# EAGLE design Placa ATMEL 2019 v2 (EAGLE 7.6.0)
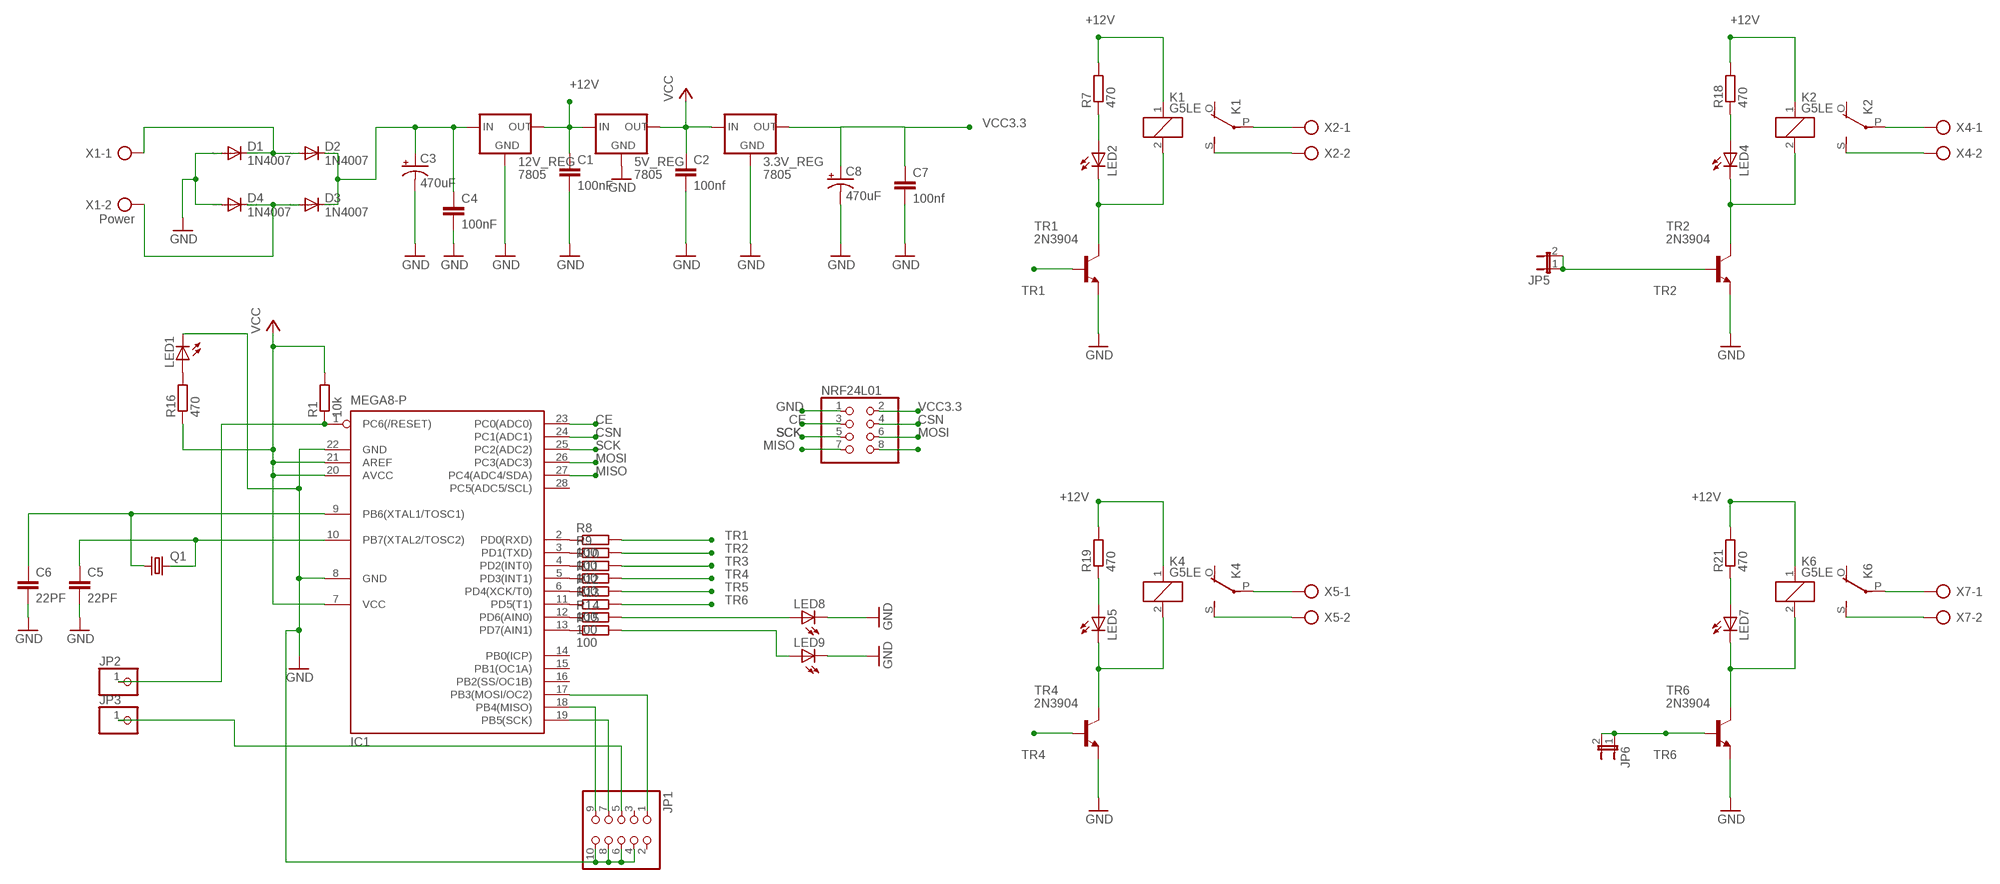
[diagram p0: schematic, sheet 1]

## Parts
3.3V_REG  7805  78XXL  [78XXL]
5V_REG  7805  78XXL  [78XXL]
12V_REG  7805  78XXL  [78XXL]
C1  100nF  C-EU050-025X075  [C050-025X075]
C2  100nf  C-EU050-025X075  [C050-025X075]
C3  470uF  CPOL-USE7.5-16  [E7,5-16]
C4  100nF  C-EU050-025X075  [C050-025X075]
C5  22PF  C-EU050-024X044  [C050-024X044]
C6  22PF  C-EU050-024X044  [C050-024X044]
C7  100nf  C-EU050-025X075  [C050-025X075]
C8  470uF  CPOL-USE7.5-16  [E7,5-16]
D1  1N4007  1N4004  [DO41-10]
D2  1N4007  1N4004  [DO41-10]
D3  1N4007  1N4004  [DO41-10]
D4  1N4007  1N4004  [DO41-10]
IC1  MEGA8-P  [DIL28-3]
JP1  PINHD-2X5  [2X05]
JP2  PINHD-1X1  [1X01]
JP3  PINHD-1X1  [1X01]
JP5  JP1E  [JP1]
JP6  JP1E  [JP1]
K1  G5LE  [G5LE]
K2  G5LE  [G5LE]
K4  G5LE  [G5LE]
K6  G5LE  [G5LE]
LED1  LED5MM  [LED5MM]
LED2  LED5MM  [LED5MM]
LED4  LED5MM  [LED5MM]
LED5  LED5MM  [LED5MM]
LED7  LED5MM  [LED5MM]
LED8  LED5MM  [LED5MM]
LED9  LED5MM  [LED5MM]
NRF24L01  PINHD-2X4  [2X04]
Q1  CRYSTALHC49S  [HC49/S]
R1  10k  R-EU_0207/10  [0207/10]
R7  470  R-EU_0309/10  [0309/10]
R8  100  R-EU_0207/10  [0207/10]
R9  100  R-EU_0207/10  [0207/10]
R10  100  R-EU_0207/15  [0207/15]
R11  100  R-EU_0207/10  [0207/10]
R12  R-EU_0207/15  [0207/15]
R13  100  R-EU_0207/15  [0207/15]
R14  100  R-EU_0207/10  [0207/10]
R15  100  R-EU_0207/10  [0207/10]
R16  470  R-EU_0309/10  [0309/10]
R18  470  R-EU_0309/10  [0309/10]
R19  470  R-EU_0309/10  [0309/10]
R21  470  R-EU_0309/10  [0309/10]
TR1  2N3904  [TO92]
TR2  2N3904  [TO92]
TR4  2N3904  [TO92]
TR6  2N3904  [TO92]
X1  Power  AK500/2  [AK500/2]
X2  AK300/2  [AK300/2]
X4  AK300/2  [AK300/2]
X5  AK300/2  [AK300/2]
X7  AK300/2  [AK300/2]

## Nets
+12V: 5V_REG.IN 12V_REG.OUT C1.1 K1.1 K2.1 K4.1 K6.1 R7.2 R18.2 R19.2 R21.2
CE: IC1.23(PC0(ADC0)) NRF24L01.3
CSN: IC1.24(PC1(ADC1)) NRF24L01.4
GND: 3.3V_REG.GND 5V_REG.GND 12V_REG.GND C1.2 C2.2 C3.- C4.2 C5.2 C6.2 C7.2 C8.- D1.A D4.A IC1.8(GND) IC1.22(GND) JP1.4 JP1.6 JP1.8 JP1.10 LED1.K(C) LED8.K(C) LED9.K(C) NRF24L01.1 TR1.3(E) TR2.3(E) TR4.3(E) TR6.3(E)
MISO: IC1.27(PC4(ADC4/SDA)) NRF24L01.7
MOSI: IC1.26(PC3(ADC3)) NRF24L01.6
N$1: JP1.5 JP3.1
N$2: 12V_REG.IN C3.+ C4.1 D2.C D3.C
N$3: K4.S(2:S) X5.2
N$4: K1.S(2:S) X2.2
N$5: K2.S(2:S) X4.2
N$6: LED2.A R7.1
N$7: IC1.2(PD0(RXD)) R8.1
N$8: IC1.3(PD1(TXD)) R9.1
N$9: IC1.4(PD2(INT0)) R10.1
N$10: IC1.5(PD3(INT1)) R11.1
N$11: IC1.6(PD4(XCK/T0)) R12.1
N$12: IC1.11(PD5(T1)) R13.1
N$13: IC1.12(PD6(AIN0)) R14.1
N$14: IC1.13(PD7(AIN1)) R15.1
N$15: K6.S(2:S) X7.2
N$16: IC1.17(PB3(MOSI/OC2)) JP1.1
N$17: LED1.A R16.2
N$18: IC1.19(PB5(SCK)) JP1.7
N$19: IC1.18(PB4(MISO)) JP1.9
N$24: D1.C D2.A X1.1
N$29: K1.2 LED2.K(C) TR1.1(C)
N$32: K1.P(2:P) X2.1
N$65: D3.A D4.C X1.2
N$71: LED4.A R18.1
N$81: K2.2 LED4.K(C) TR2.1(C)
N$84: K2.P(2:P) X4.1
N$85: LED5.A R19.1
N$86: K4.2 LED5.K(C) TR4.1(C)
N$89: K4.P(2:P) X5.1
N$111: IC1.1(PC6(/RESET)) JP2.1 R1.1
N$118: LED7.A R21.1
N$135: C5.1 IC1.10(PB7(XTAL2/TOSC2)) Q1.2
N$136: C6.1 IC1.9(PB6(XTAL1/TOSC1)) Q1.1
N$138: K6.2 LED7.K(C) TR6.1(C)
N$148: K6.P(2:P) X7.1
N$152: LED8.A R14.2
N$153: LED9.A R15.2
N$157: NRF24L01.8
SCK: IC1.25(PC2(ADC2)) NRF24L01.5
TR1: R8.2 TR1.2(B)
TR2: JP5.1 JP5.2 R9.2 TR2.2(B)
TR3: R10.2
TR4: R11.2 TR4.2(B)
TR5: R12.2
TR6: JP6.1 JP6.2 R13.2 TR6.2(B)
VCC: 3.3V_REG.IN 5V_REG.OUT C2.1 IC1.7(VCC) IC1.20(AVCC) IC1.21(AREF) R1.2 R16.1
VCC3.3: 3.3V_REG.OUT C7.1 C8.+ NRF24L01.2
Unconnected: IC1.14(PB0(ICP)) IC1.15(PB1(OC1A)) IC1.16(PB2(SS/OC1B)) IC1.28(PC5(ADC5/SCL)) JP1.2 JP1.3 K1.O(2:O) K2.O(2:O) K4.O(2:O) K6.O(2:O)

## Library data of the parts
3.3V_REG 5V_REG 12V_REG = v-reg:78XXL: VOLTAGE REGULATOR
C1 C2 C4-C7 = rcl:C-EU: CAPACITOR, European symbol
C3 C8 = rcl:CPOL-US: POLARIZED CAPACITOR, American symbol
D1-D4 = diode:1N4004: DIODE general purpose rectifier, 1 A
IC1 = atmel:MEGA8-P: MICROCONTROLLER 8 Kbytes FLASH, 1 kbytes SRAM, 512 bytes EEPROM, USART, 4-channel 10 bit ADC, 2-channel 8 bit ADC Pin compatible with Atmega48, ATMega88, ATMega168 Source: avr.lbr; OC_FARNELL: unknown; OC_NEWARK: unknown
JP1 = pinhead:PINHD-2X5: PIN HEADER
JP2 JP3 = pinhead:PINHD-1X1: PIN HEADER
JP5 JP6 = jumper:JP1E: JUMPER
K1 K2 K4 K6 = relay:G5LE: RELAY 1 x switch, 10 A/120 V AC, 8 A/30 V DC, Omron; OC_FARNELL: unknown; OC_NEWARK: unknown
LED1 LED2 LED4 LED5 LED7-LED9 = led:LED: LED OSRAM: - CHIPLED LG R971, LG N971, LY N971, LG Q971, LY Q971, LO R971, LY R971 LH N974, LH R974 LS Q976, LO Q976, LY Q976 LO Q996 - Hyper CHIPLED LW Q18S LB Q993, LB Q99A, LB R99A - SideLED LS A670, LO A670, LY A670, LG A670, LP A670 LB A673, LV A673, LT A673, LW A673 LH A674 LY A675 LS A676, LA A676, LO A676, LY A676, LW A676 LS A679, LY A679, LG A679 - Hyper Micro SIDELED® LS Y876, LA Y876, LO Y876, LY Y876 LT Y87S - SmartLED LW L88C, LW L88S LB L89C, LB L89S, LG L890 LS L89K, LO L89K, LY L89K LS L896, LA L896, LO L896, LY L896 - TOPLED LS T670, LO T670, LY T670, LG T670, LP T670 LSG T670, LSP T670, LSY T670, LOP T670, LYG T670 LG T671, LOG T671, LSG T671 LB T673, LV T673, LT T673, LW T673 LH T674 LS T676, LA T676, LO T676, LY T676, LB T676, LH T676, LSB T676, LW T676 LB T67C, LV T67C, LT T67C, LS T67K, LO T67K, LY T67K, LW E67C LS E67B, LA E67B, LO E67B, LY E67B, LB E67C, LV E67C, LT E67C LW T67C LS T679, LY T679, LG T679 LS T770, LO T770, LY T770, LG T770, LP T770 LB T773, LV T773, LT T773, LW T773 LH T774 LS E675, LA E675, LY E675, LS T675 LS T776, LA T776, LO T776, LY T776, LB T776 LHGB T686 LT T68C, LB T68C - Hyper Mini TOPLED® LB M676 - Mini TOPLED Santana® LG M470 LS M47K, LO M47K, LY M47K Source: http://www.osram.convergy.de LUXEON: - LUMILED® LXK2-PW12-R00, LXK2-PW12-S00, LXK2-PW14-U00, LXK2-PW14-V00 LXK2-PM12-R00, LXK2-PM12-S00, LXK2-PM14-U00 LXK2-PE12-Q00, LXK2-PE12-R00, LXK2-PE12-S00, LXK2-PE14-T00, LXK2-PE14-U00 LXK2-PB12-K00, LXK2-PB12-L00, LXK2-PB12-M00, LXK2-PB14-N00, LXK2-PB14-P00, LXK2-PB14-Q00 LXK2-PR12-L00, LXK2-PR12-M00, LXK2-PR14-Q00, LXK2-PR14-R00 LXK2-PD12-Q00, LXK2-PD12-R00, LXK2-PD12-S00 LXK2-PH12-R00, LXK2-PH12-S00 LXK2-PL12-P00, LXK2-PL12-Q00, LXK2-PL12-R00 Source: www.luxeon.com KINGBRIGHT: KA-3528ASYC Source: www.kingbright.com
NRF24L01 = pinhead:PINHD-2X4: PIN HEADER
Q1 = crystal:CRYSTAL: CRYSTAL; OC_FARNELL: 1667008; OC_NEWARK: unknown
R1 R7-R16 R18 R19 R21 = rcl:R-EU_: RESISTOR, European symbol
TR1 TR2 TR4 TR6 = transistor-npn:2N3904: NPN Transistor
X1 = con-ptr500:AK500/2: CONNECTOR; OC_FARNELL: unknown; OC_NEWARK: unknown
X2 X4 X5 X7 = con-ptr500:AK300/2: CONNECTOR; OC_FARNELL: unknown; OC_NEWARK: unknown

## Board
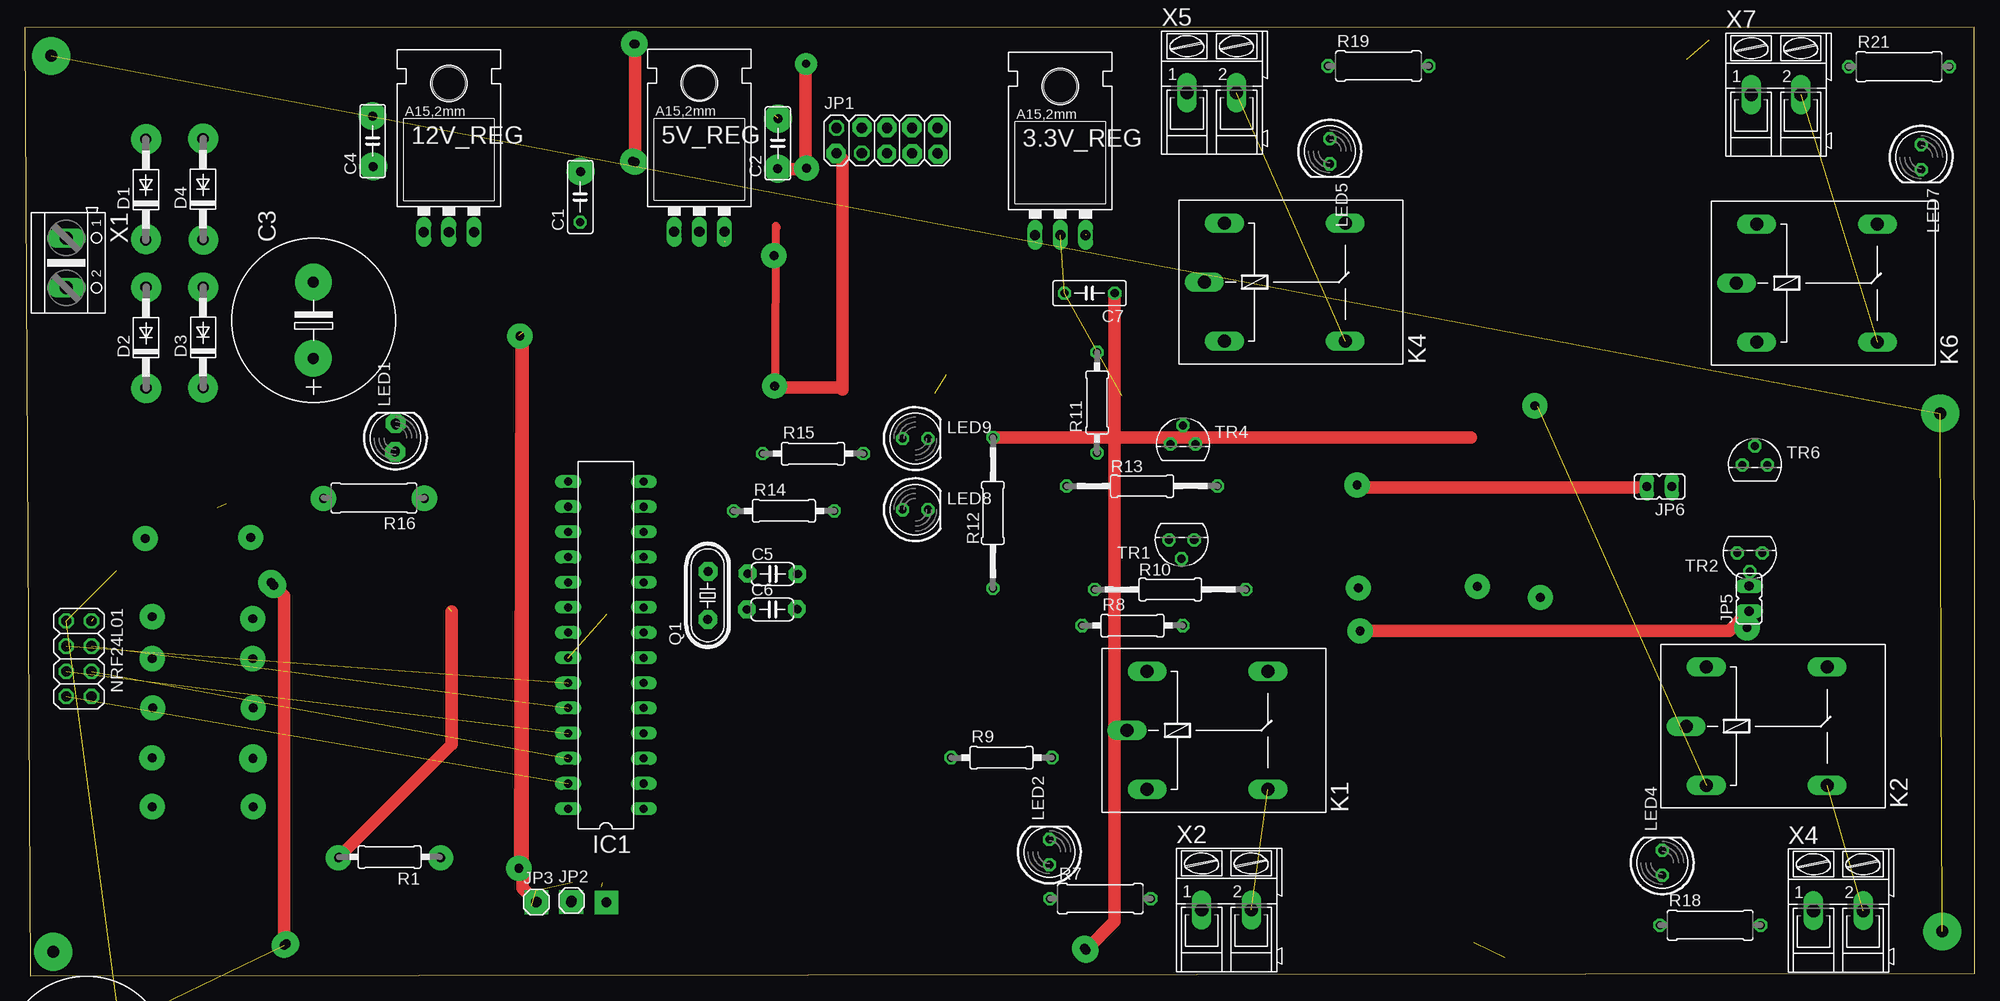
[diagram p1: board, top side]
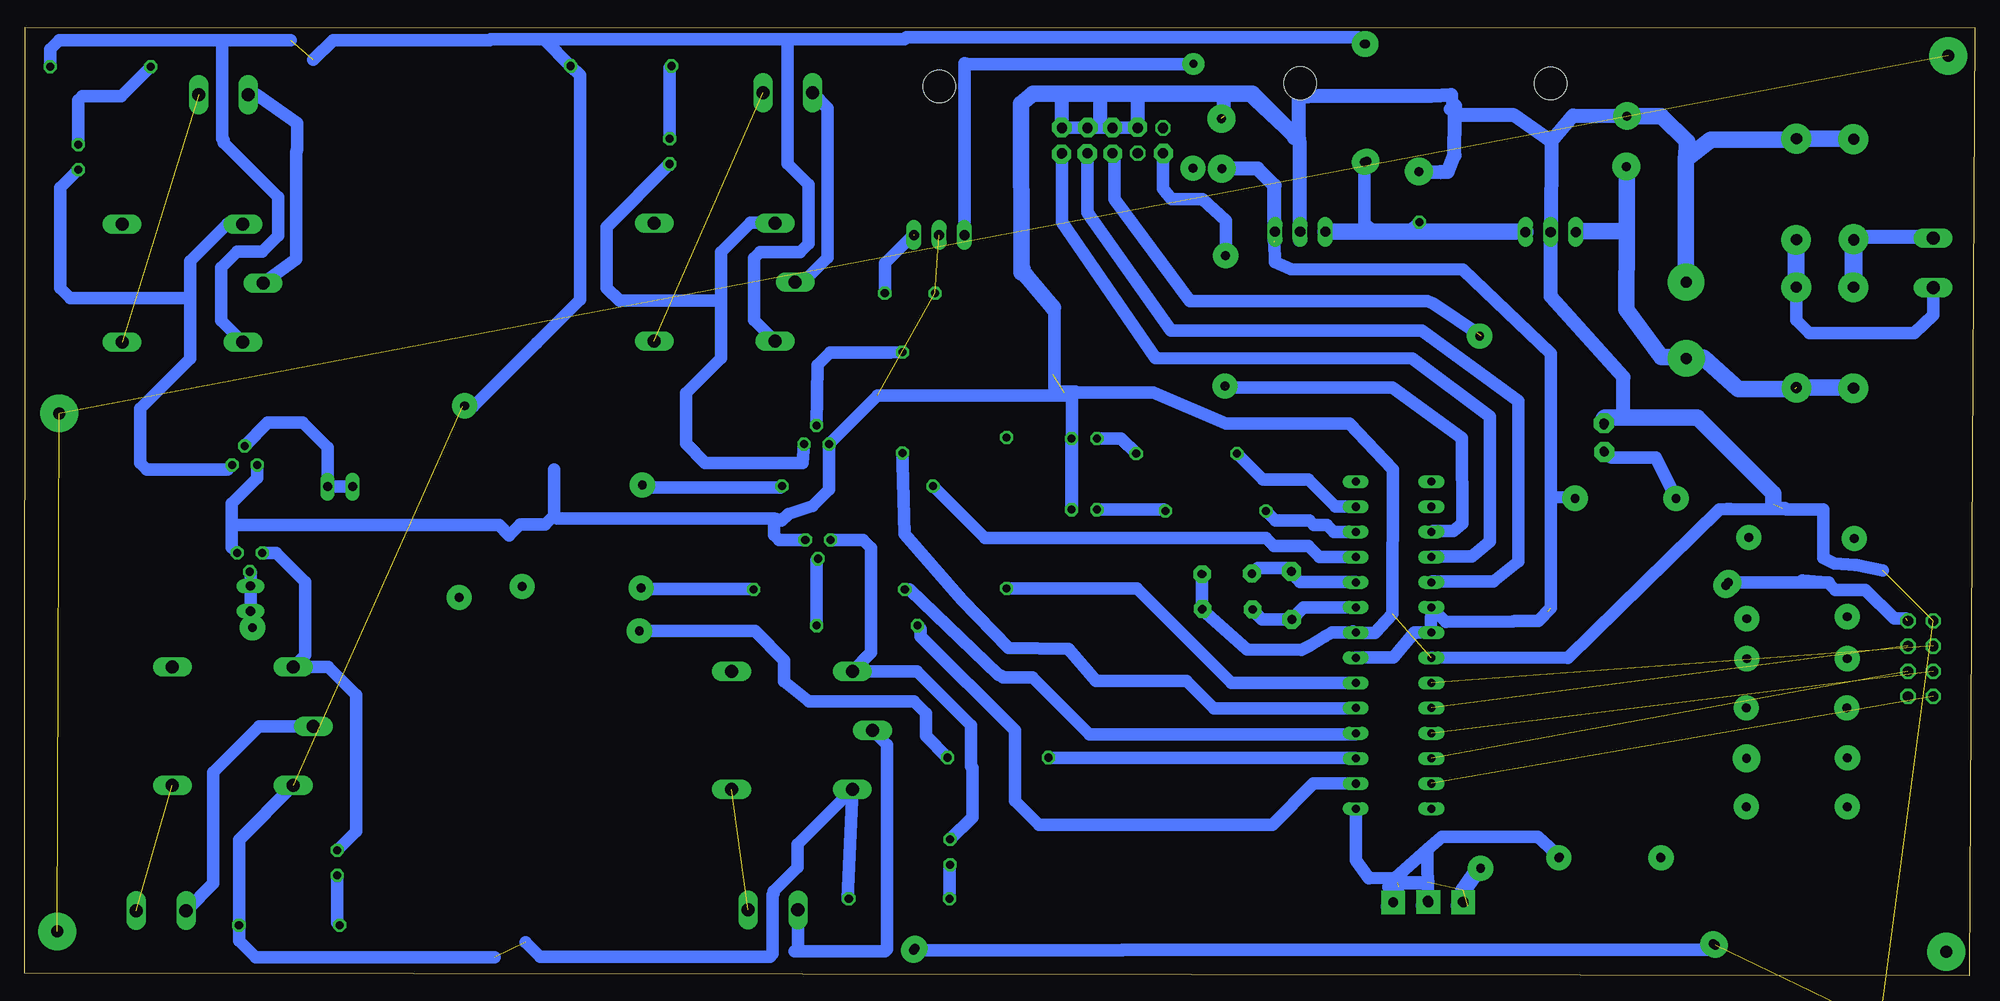
[diagram p2: board, bottom side, seen from below]

Size 196.74 x 95.72 mm. Coordinates in mm from the lower left corner, seen from the top.
Outline: 0.57,0 196.74,0.28 196.7,95.72 0,95.7 0.57,0
Copper layers (1*16): Top 0.035mm / dielectric 1.5mm / Bottom 0.035mm
Design rules "default *": minimum track width 10mil, minimum drill 24mil, track to track 1mm, track to pad 1mm, pad to pad 1mm, via to via 1mm, smd to smd 1mm, copper to edge 1mm, drill to drill 1mm, minimum pad ring 10mil, minimum via ring 8mil, stop-mask expansion 4mil, vias tented up to drill 0mil, thermal gap 10mil

### Footprints (pad centres in the part's own frame; a part is rotated, then mirrored left to right if it is on the bottom)
78XXL = drill 1.016 long: GND 0,-3.81; IN -2.54,-3.81; OUT 2.54,-3.81 | hole 3.302: 0,11.176
C050-025X075 = drill 0.813 octagon: 1 -2.54,0; 2 2.54,0
E7,5-16 = drill 1.016 pad 3.15: + -3.81,0 | drill 1.016 pad 3.15 octagon: - 3.81,0
C050-024X044 = drill 0.813 octagon: 1 -2.54,0; 2 2.54,0
DO41-10 = drill 1.118: A 5.08,0; C -5.08,0
DIL28-3 = drill 0.813 long: 1 -16.51,-3.81; 2 -13.97,-3.81; 3 -11.43,-3.81; 4 -8.89,-3.81; 5 -6.35,-3.81; 6 -3.81,-3.81; 7 -1.27,-3.81; 8 1.27,-3.81; 9 3.81,-3.81; 10 6.35,-3.81; 11 8.89,-3.81; 12 11.43,-3.81; 13 13.97,-3.81; 14 16.51,-3.81; 15 16.51,3.81; 16 13.97,3.81; 17 11.43,3.81; 18 8.89,3.81; 19 6.35,3.81; 20 3.81,3.81; 21 1.27,3.81; 22 -1.27,3.81; 23 -3.81,3.81; 24 -6.35,3.81; 25 -8.89,3.81; 26 -11.43,3.81; 27 -13.97,3.81; 28 -16.51,3.81
2X05 = drill 1.016 octagon: 1 -5.08,-1.27; 2 -5.08,1.27; 3 -2.54,-1.27; 4 -2.54,1.27; 5 0,-1.27; 6 0,1.27; 7 2.54,-1.27; 8 2.54,1.27; 9 5.08,-1.27; 10 5.08,1.27
1X01 = drill 1.016 octagon: 1 0,0
JP1 = drill 0.914 long: 1 0,-1.27; 2 0,1.27
G5LE = drill 1.321 long: 1 -7.493,-5.969; 2 -7.493,5.969; O 4.699,5.969; P -9.525,0; S 4.699,-5.969
LED5MM = drill 0.813 octagon: A -1.27,0; K 1.27,0
2X04 = drill 1.016 octagon: 1 -3.81,-1.27; 2 -3.81,1.27; 3 -1.27,-1.27; 4 -1.27,1.27; 5 1.27,-1.27; 6 1.27,1.27; 7 3.81,-1.27; 8 3.81,1.27
HC49/S = drill 0.813: 1 -2.413,0; 2 2.413,0
0207/10 = drill 0.813 octagon: 1 -5.08,0; 2 5.08,0
0309/10 = drill 0.813 octagon: 1 -5.08,0; 2 5.08,0
0207/15 = drill 0.813 octagon: 1 -7.62,0; 2 7.62,0
TO92 = drill 0.813 octagon: 1 1.27,0; 2 0,1.905; 3 -1.27,0
AK500/2 = drill 1.321 long: 1 -2.515,0; 2 2.515,0
AK300/2 = drill 1.321 long: 1 -2.515,0; 2 2.489,0

### Placement (x,y rotation side)
3.3V_REG  104.48,78.59 0 top
5V_REG  68.06,78.91 0 top
12V_REG  42.79,78.88 0 top
C1  56.05,78.61 90 top
C2  75.98,84.02 90 top
C3  29.15,66.17 90 top
C4  35.11,84.26 90 top
C5  75.47,40.56 0 top
C6  75.42,36.98 0 top
C7  107.43,68.9 180 top
C8  6.22,-8.34 0 top  (outside the outline)
D1  12.22,79.36 90 top
D2  12.23,64.42 90 top
D3  17.99,64.45 90 top
D4  17.98,79.4 90 top
IC1  58.63,33.38 90 top
JP1  86.99,84.31 0 top
JP2  55.17,7.6 0 top
JP3  51.62,7.46 0 top
JP5  173.97,38.08 0 top
JP6  164.93,49.38 90 top
K1  120.73,24.78 0 top
K2  177.15,25.2 0 top
K4  128.53,70.02 0 top
K6  182.23,69.92 0 top
LED1  37.4,54.28 90 top
LED2  103.37,12.5 90 top
LED4  165.21,11.42 90 top
LED5  131.67,83.22 270 top
LED7  191.34,82.63 270 top
LED8  89.85,47.05 0 top
LED9  89.85,54.23 0 top
NRF24L01  5.46,32.01 270 top
Q1  68.9,38.41 90 top
R1  36.8,12 180 top
R7  108.52,7.8 0 top
R8  111.76,35.35 0 top
R9  98.54,22.03 0 top
R10  115.57,39 0 top
R11  108.19,57.87 90 top
R12  97.68,46.73 90 top
R13  112.73,49.43 0 top
R14  76.59,46.94 0 top
R15  79.52,52.7 0 top
R16  35.22,48.24 180 top
R18  170.05,5.12 0 top
R19  136.58,91.83 0 top
R21  189.1,91.76 0 top
TR1  116.72,44.01 180 top
TR2  174.04,42.7 180 top
TR4  116.86,53.66 0 top
TR6  174.56,51.58 0 top
X1  4.19,71.96 270 top
X2  121.26,6.66 0 top
X4  182.99,6.58 0 top
X5  119.78,89.14 0 top
X7  176.7,88.93 0 top

### Tracks (layer width: path | path; a pad name or v marks a point on that pad's centre or on a via)
+12V  (via drill 0.9 pad 2.54)  (3 unrouted)
  Top 1.27: v61.56,82.12 v61.56,94.05
  Bottom 1.27: R7.2 113.71,7.79 K1.1 118.78,13.27 118.78,10.97 121.2,8.55 121.2,8.27 121.29,8.18 121.29,2.23 121.57,1.95 144.73,1.95 146.2,3.42 | 149.35,1.86 173.46,1.86 175.13,3.53 R18.2 175.13,13.76 K2.1 | 144.36,94.53 R19.2 140.73,90.9 140.73,68.23 145.1,63.86 151.52,57.44 152.62,57.44 | 144.36,94.53 149.75,94.53 149.84,94.44 165.65,94.44 167.62,92.47 | 169.9,94.44 176.8,94.44 | 176.8,94.44 193.26,94.44 194.18,93.52 R21.2 | K4.1 123.17,66.18 123.17,72.42 122.55,73.04 118.52,73.04 117.67,73.89 117.67,79.86 119.76,81.95 119.76,94.27 120.02,94.53 | 120.02,94.53 121.27,94.53 144.36,94.53 | K6.1 176.94,66.15 176.94,71.49 175.33,73.1 172.79,73.1 171.18,74.71 171.18,78.59 176.67,84.08 176.67,84.35 176.8,84.48 176.8,94.44 | C1.1 57.02,75.1 60.56,75.1 | 5V_REG.IN 65.42,75.2 60.78,75.2 61.56,75.98 v61.56,82.12 61.56,82.23 | v61.56,94.05 62.23,94.72 107.77,94.72 107.96,94.53 120.02,94.53
  Bottom 1.676: 5V_REG.IN 60.56,75.1 45.33,75.1 12V_REG.OUT
CE  (1 unrouted)
CSN  (1 unrouted)
GND  (via drill 0.9 pad 2)  (7 unrouted)
  Bottom 1.27: 5V_REG.GND 68.1,74.26 | 84.45,88.88 82.96,88.94 75.79,88.94 73.44,89.08 68.1,84.1 68.23,84.19 | JP1.4 JP1.6 JP1.8 JP1.10 | 52.44,86.86 52.44,87.82 | C5.2 77.97,39.82 C6.2 73.41,32.95 67.94,32.9 67.14,33.3 65.58,34.26 64.84,34.64 IC1.8 62.74,34.75 62.69,34.61 60.5,34.6 58.75,36.55 | 58.75,36.55 60.05,35.11 | 37.49,56.17 37.49,55.86 v37.42,55.78 v37.4,55.78 v37.39,55.77 v37.4,55.76 LED1.K | 58.75,36.55 58.7,51.1 63.11,55.73 75.54,55.73 82.87,58.88 91.08,58.86 91.08,58.57 | IC1.22 54.79,32.14 41.07,32.1 25.75,47.05 24.95,47.14 24.65,47.11 19.03,47.09 | 52.8,88.92 52.63,87.81 52.97,87.46 52.45,87.46 52.45,86.68 | 143.33,51.13 143.33,46.47 | 143.33,46.47 144.25,45.55 146.77,45.55 147.85,44.47 148.88,45.5 175.87,45.5 | TR2.3 175.87,43.26 175.87,45.5 | 175.87,45.5 175.87,47.68 173.29,50.26 TR6.3 | 121.16,46.15 120.36,45.94 119.69,46.61 117.25,47.41 115.58,49.08 115.58,51.93 TR4.3 110.68,58.57 91.08,58.57 | 121.16,46.15 121.16,44.51 120.66,44.01 TR1.3 | 143.33,46.47 143.01,46.15 121.16,46.15 | 9.27,40.9 11.95,41.46 12.04,41.46 14.18,41.64 15.3,42.2 15.3,47.1 15.31,47.09 19.03,47.09 | 19.03,47.09 19.16,47.22 19.39,47.22 | LED9.K LED8.K 91.08,47.09 91.08,58.57
  Bottom 1.422: 68.1,74.26 68.1,84.1 | 84.45,88.88 JP1.4 | 42.73,84.23 40.53,86.82 C4.2 | 42.73,84.23 46.47,86.86 52.44,86.86 | C1.2 53.91,81.13 53.18,81.15 52.48,82.81 52.45,86.68 52.44,87.82 | 75.72,86.82 75.79,88.94 | 68.23,84.19 68.16,84.45 68.16,88.72 66.13,88.82 54.88,88.82 52.8,88.92 | 42.83,74.71 12V_REG.GND | 42.73,84.23 42.77,74.95 12V_REG.GND | 27.97,56.35 28.04,56.42 35.18,56.42 35.45,56.69 35.45,60.43 42.79,68.57 12V_REG.GND
  Bottom 1.676: D1.A 12.26,84.48 D4.A 18.08,84.38 26.61,84.38 29.16,82.41 | 29.16,82.41 C3.- | C4.2 34.93,86.75 31.62,86.75 29.02,84.19 29.16,82.41 | 37.49,56.17 37.31,56.35 27.97,56.35 20.3,48.68 20.3,47.63
MISO  (1 unrouted)
MOSI  (1 unrouted)
N$1  (1 unrouted)
  Top 1.27: JP3.1 50.23,8.85 50.23,64.91
  Bottom 1.27: JP1.5 86.82,82.68 86.82,78.41 79.18,68.09 55.22,68.08 54.63,67.85 49.81,64.62
N$2  (1 unrouted)
  Bottom 1.422: C3.+ 29.43,62.64 | 12V_REG.IN 40.21,75.11
  Bottom 1.676: D2.C 12.26,59.37 D3.C | 18.14,59.22 23.87,59.22 27.37,62.41 C3.+ | 29.43,62.64 29.63,62.44 31.64,62.44 35.14,67.27 35.11,75.17 | 35.11,75.17 C4.1 | 40.21,75.11 40.15,75.17 35.11,75.17
N$3  (1 unrouted)
N$4  (1 unrouted)
N$5  (1 unrouted)
N$6
  Bottom 1.27: LED2.A 103.44,11.16 R7.1
N$7
  Bottom 1.27: R8.1 106.35,35.02 106.35,34.27 96.84,24.76 96.84,17.67 94.43,15.26 70.85,15.26 66.7,19.41 IC1.2
N$8
  Bottom 1.27: IC1.3 62.52,22.03 R9.1
N$9
  Bottom 1.27: IC1.4 62.56,24.37 89.34,24.37 95.09,30.12 98.04,30.12 98.18,30.26 98.52,30.38 107.45,39 R10.1
N$10
  Bottom 1.27: IC1.5 62.47,27 76.74,27 79.52,29.78 88.68,29.78 91.46,32.98 97.49,33.08 102.18,37.95 107.98,44.62 108.17,51.72 R11.1
N$11
  Bottom 1.27: IC1.6 62.46,29.59 75,29.59 84.52,39.11 R12.1
N$12
  Bottom 1.27: R13.1 99.86,44.18 71.51,44.18 70.71,43.38 67.23,43.38 66.12,42.27 IC1.11
N$13
  Bottom 1.27: R14.1 70.53,45.96 67.14,45.96 66.69,45.51 65.36,45.51 64.66,44.81 IC1.12
N$14
  Bottom 1.27: R15.1 71.83,50.09 67.25,50.09 64.51,47.35 IC1.13
N$15  (1 unrouted)
N$16  (1 unrouted)
  Top 1.27: JP1.1 82.5,82.45 82.5,59.18 82.31,59.37 75.57,59.37
  Bottom 1.27: IC1.17 54.61,44.88 52.62,44.88 51.7,45.64 51.75,54.29 58.73,59.38 75.57,59.37
N$17
  Bottom 1.27: R16.2 32.18,52.34 34.96,52.31 36.65,52.33 LED1.A
N$18
  Bottom 1.27: IC1.19 54.74,39.81 48.58,39.81 46.04,41.83 46.02,58.01 55.77,65.15 81.1,65.15 89.53,77.04 JP1.7
N$19
  Bottom 1.27: IC1.18 54.74,42.35 50.75,42.35 48.93,43.82 48.92,56.45 56.76,62.32 82.66,62.36 92.07,76.07 JP1.9
N$23  (via drill 0.9 pad 2)
  other vias: 37.38,52.87
N$24
  Bottom 1.27: X1.1 4.13,74.55 | 11.89,74.28 D1.C
  Bottom 1.422: 4.13,74.55 12.22,74.55 D1.C
  Bottom 1.8: D1.C D2.A
N$29
  Bottom 1.27: TR1.1 112.18,44.01 111.34,43.17 111.34,32.65 K1.2 106.71,30.75 101.26,25.3 101.26,21.15 101.13,21.02 101.13,16.01 LED2.K
N$30  (via drill 0.9 pad 2.54)
  other vias: 78.89,81.52
N$32
  Bottom 1.27: K1.P 109.76,23.34 109.76,2.7 109.95,2.51 119.06,2.51 118.74,2.83 X2.1
N$35  (via drill 0.9 pad 2.54)
  other vias: 134.55,39.15
N$38  (via drill 0.9 pad 2.54)
  other vias: 49.85,10.86
N$41  (via drill 1.2 pad 3.81)
  other vias: 2.87,2.45
N$42  (via drill 0.9 pad 2.54)
  other vias: 146.56,39.31
N$43  (via drill 0.9 pad 1.93)
  other vias: 89.49,85.63
N$46  (via drill 0.9 pad 2.54)
  other vias: 31.65,11.91
N$47  (via drill 0.9 pad 2.54)
  other vias: 41.97,11.93
N$48
  Bottom 1.27: 75.57,72.76 75.55,76.24 77.92,78.38 81.06,78.41 81.89,79.47 81.89,82.78
N$49  (via drill 0.9 pad 2.54)
  other vias: 12.16,44.16
N$50  (via drill 0.9 pad 2.54)
  other vias: 12.86,36.25
N$51  (via drill 0.9 pad 2.54)
  other vias: 23.01,36.05
N$52  (via drill 0.9 pad 2.54)
  other vias: 75.64,59.53
N$53
  Bottom 1.27: 68.04,74.43 67.92,74.31
N$54  (3 unrouted)
  Bottom 1.422: 52.16,7.11 51.16,7.1 | 58.24,9.41 55.22,9.45 | 59.09,8.98 58.15,9.01
  Bottom 1.676: 50.16,10.68 51.59,8.62
N$55  (via drill 0.9 pad 1.93)
  other vias: 92.15,82.94
N$56  (via drill 0.9 pad 1.93)
  other vias: 81.86,83.01
N$59  (via drill 0.9 pad 1.93)
  other vias: 89.55,82.96
N$60  (via drill 0.9 pad 1.93)
  other vias: 86.99,85.63
N$61  (via drill 0.9 pad 1.93)
  other vias: 92.12,85.63
N$62  (via drill 0.9 pad 2.54)
  other vias: 134.73,34.81
N$63  (via drill 1.2 pad 3.81)  (2 unrouted)
  other vias: 2.66,92.85 193.27,56.77 193.47,4.49
N$64  (via drill 0.9 pad 1.85)
  other vias: 86.98,82.98
N$65
  Bottom 1.27: X1.2 4.18,69.47 4.18,66.7 6.09,64.88 16.68,64.88 17.99,66.19 D3.A
  Bottom 1.7: D3.A D4.C
N$66  (via drill 0.9 pad 2.54)
  other vias: 75.58,72.7
N$67
  Bottom 1.422: 54.66,7.07 55.7,7.08
N$69  (via drill 0.9 pad 2.8)
  other vias: 23.02,21.95
N$70  (via drill 0.9 pad 2.54)
  other vias: 22.8,44.25
N$71
  Bottom 1.27: R18.1 165.21,5.36 LED4.A
N$73  (via drill 0.9 pad 2.54)
  other vias: 12.86,32.02
N$74  (via drill 0.9 pad 2.54)
  other vias: 23.01,32.02
N$75  (via drill 0.9 pad 2.54)
  other vias: 23.05,27.06
N$76  (via drill 0.9 pad 2.54)
  other vias: 12.9,27.06
N$77  (via drill 0.9 pad 2.54)
  other vias: 12.84,22
N$78  (via drill 0.9 pad 2.54)
  other vias: 12.86,17.08
N$79  (via drill 0.9 pad 2.54)
  other vias: 23.05,17.08
N$81
  Bottom 1.27: LED4.K 163.32,14.58 163.32,28.35 166.14,31.17 K2.2 168.44,32.39 168.44,39.78 171.36,42.7 TR2.1
N$82  (via drill 0.9 pad 2.54)
  other vias: 152.9,38.2
N$84
  Bottom 1.27: X4.1 177.73,9.32 177.73,20.54 173.07,25.2 K2.P
N$85
  Bottom 1.27: R19.1 131.67,91.66 LED5.A
N$86
  Bottom 1.27: TR4.1 118.28,51.77 128.08,51.77 130.03,53.72 130.03,58.84 126.5,62.37 126.5,68.13 | 126.5,68.13 126.5,73.06 123.53,76.03 120.46,76.03 120.5,75.99 K4.2 | LED5.K 138.03,75.59 138.03,69.43 136.73,68.13 126.5,68.13
N$87  (via drill 0.9 pad 2.54)
  other vias: 173.77,35.14
N$89
  Bottom 1.27: X5.1 115.72,87.59 115.72,72.5 118.2,70.02 K4.P
N$92  (via drill 0.9 pad 2.54)
  other vias: 134.43,49.53
N$94  (via drill 0.9 pad 2.54)
  other vias: 49.95,64.57
N$95
  Bottom 1.422: 58.24,6.99 59.21,6.99
N$98
  Top 0.813: 75.86,75.54 75.75,75.69 75.72,60.13
N$101  (via drill 1 pad 3)
  other vias: 12.25,84.45
N$102  (via drill 1 pad 3)
  other vias: 17.99,84.5
N$103  (via drill 1 pad 3)
  other vias: 18.02,74.29
N$104  (via drill 1 pad 3)
  other vias: 12.22,74.35
N$105  (via drill 1 pad 3)
  other vias: 18,69.48
N$106  (via drill 1 pad 3)
  other vias: 12.25,69.48
N$107  (via drill 1 pad 3)
  other vias: 17.97,59.36
N$108  (via drill 1 pad 3)
  other vias: 12.25,59.29
N$111
  Bottom 1.27: R1.1 44.1,14.02 53.75,14.03 55.22,12.77 | 55.22,12.77 JP2.1 | 55.22,12.77 58.47,9.89 61.13,9.87 62.44,11.66 IC1.1
N$114  (via drill 1 pad 2.4)
  other vias: 51.61,7.44
N$115  (via drill 1 pad 2.4)
  other vias: 55.11,7.45
N$116  (via drill 0.9 pad 2.54)
  other vias: 152.35,57.54
N$117
  Top 0.61: 50.19,10.99 49.7,9.96 49.83,63.8
N$118
  Bottom 1.27: R21.1 187.01,88.77 190.94,88.77 191.34,88.37 LED7.A
N$119  (via drill 0.9 pad 2.54)
  other vias: 26.4,3.23
N$120  (via drill 1 pad 2.4)
  other vias: 58.68,7.41
N$124  (via drill 0.9 pad 2.8)
  other vias: 35.08,86.78
N$125  (via drill 0.9 pad 2.8)
  other vias: 35.16,81.69
N$126  (via drill 0.9 pad 2.8)
  other vias: 56.07,81.18
N$127  (via drill 0.9 pad 2.8)
  other vias: 75.99,86.52
N$128  (1 unrouted)
  Bottom 1.27: 93.02,67.47 92.86,67.47 92.86,58.98 90.73,58.98 90.73,58.82 90.86,58.95 91.82,58.95 91.82,58.82
  Bottom 1.676: 93.02,67.47 95.74,70.66
N$129
  Bottom 1.676: 96.1,71.4 96.2,70.98 96.21,88.02 95.01,89.05 72.9,89.05 68.6,84.75 68.6,84.64
N$130
  Bottom 1.422: 88.2,85.67 88.23,85.7 88.23,88.71
N$131  (via drill 0.9 pad 1.93)
  other vias: 84.49,85.66
N$132  (via drill 1.1 pad 3.7)
  other vias: 29.1,62.32
N$133  (via drill 1.1 pad 3.7)
  other vias: 29.11,70.02
N$134
  Bottom 1.422: 92.05,85.79 92.08,85.79 92.08,88.62
N$135
  Bottom 1.27: IC1.10 62.48,39.77 68.08,39.77 68.9,40.59 Q1.2 69.23,41.15 72.32,41.15 72.91,40.56 C5.1
N$136
  Bottom 1.27: C6.1 71.9,36 Q1.1 67.71,37.19 IC1.9
N$137  (via drill 0.8 pad 1.78)
  other vias: 72.84,36.99
N$138
  Bottom 1.27: TR6.1 176.29,51.12 184.43,51.12 185.08,51.77 185.08,57.26 180.06,62.28 180.06,68.41 | 180.06,68.41 180.06,72.13 176.3,75.89 K6.2 | LED7.K 193.17,79.53 193.17,69.43 192.15,68.41 180.06,68.41
N$139  (via drill 0.9 pad 2.54)
  other vias: 40.32,48.2
N$140  (via drill 0.9 pad 2.54)
  other vias: 30.13,48.19
N$141  (via drill 0.8 pad 1.78)
  other vias: 72.93,40.61
N$142  (via drill 0.8 pad 1.78)
  other vias: 77.93,40.54
N$143  (via drill 0.8 pad 1.78)
  other vias: 77.9,37.03
N$144  (via drill 0.9 pad 2.54)
  other vias: 25.1,39.39
N$145  (via drill 0.9 pad 1.9)
  other vias: 68.93,40.82
N$146  (via drill 0.9 pad 1.9)
  other vias: 68.91,35.99
N$148
  Bottom 1.27: K6.P 169.35,72.33 169.35,83.1 169.26,83.46 169.26,86.06 173.34,88.93 X7.1
N$149  (via drill 0.9 pad 2.54)
  other vias: 106.91,2.8
N$150  (via drill 0.9 pad 2.54)
  other vias: 61.34,82.23
N$151  (via drill 0.9 pad 2.54)
  other vias: 61.45,94.05
N$152
  Bottom 1.27: R14.2 81.78,47.05 LED8.A
N$153
  Bottom 1.27: R15.2 86.13,54.23 LED9.A
N$154  (via drill 0.8 pad 2.18)
  other vias: 78.82,92.05
SCK  (1 unrouted)
TR1
  Bottom 1.27: TR1.2 116.84,41.98 R8.2
TR2  (1 unrouted)
  Top 1.27: JP5.1 171.97,34.81 134.73,34.81
  Bottom 1.27: 134.73,34.81 123.08,34.81 120.13,31.86 120.13,29.72 117.59,27.72 107.02,27.72 105.81,26.51 105.81,24.22 R9.2 | TR2.2 173.97,40.73 JP5.2 JP5.1
TR3
  Bottom 1.27: R10.2 123.23,39.04 134.89,39.04
TR4
  Bottom 1.27: R11.2 109.37,62.92 115.47,62.92 116.73,61.66 TR4.2
TR5
  Top 1.27: 145.91,54.35 R12.2
TR6  (1 unrouted)
  Top 1.27: JP6.2 162.55,49.31 134.77,49.31
  Bottom 1.27: R13.2 120.47,49.31 134.77,49.31 | TR6.2 172.22,55.83 168.71,55.83 166.2,53.32 JP6.1 JP6.2
VCC  (via drill 0.9 pad 2.8)  (3 unrouted)
  Top 1.27: R1.2 43.09,23.36 43.09,36.77 | C2.1 76.04,81.42 79.17,81.42 78.8,81.79 78.8,92.49
  Bottom 1.27: 70.64,74.04 70.62,72.03 68.99,71.31 51.63,71.29 42.78,62.79 42.74,48.29 | IC1.7 62.41,32.14 58.63,32.14 56.54,34.65 IC1.21 54.87,35.57 IC1.20 53.37,35.74 46.61,35.75 46.4,35.84 44.02,35.84 42.74,37.12 42.74,48.29 | R16.1 39.9,48.35 42.74,48.29 | 3.3V_REG.IN 101.95,92.11 101.48,92 78.8,92 78.8,92.49
  Bottom 1.422: 5V_REG.OUT 70.65,74.15 70.65,79.77 72.36,81.48 v75.97,81.48 C2.1
VCC3.3  (via drill 0.9 pad 2.54)  (3 unrouted)
  Top 1.27: v24.84,39.69 26.17,38.36 v26.17,3.1 | v107.08,2.6 109.97,5.49 C7.1
  Bottom 1.27: 6.97,36.06 8.14,36.06 11.03,38.95 14.09,38.95 14.83,39.69 17.42,39.92 16.7,39.69 | 16.7,39.69 14.74,39.69 | 16.7,39.69 v24.84,39.69 | v26.17,3.1 26.64,2.63 85.98,2.63 86.01,2.6 v107.08,2.6 | 107.07,74.83 109.97,71.93 C7.1